# EAGLE design SolenoidBoard (EAGLE 9.4.1)
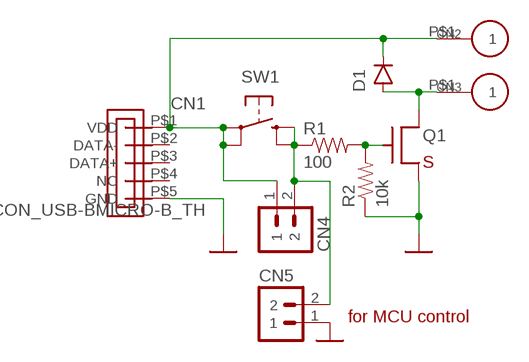
[diagram p0: schematic, sheet 1]

## Parts
CN1  CON_USB-BMICRO-B_TH  [USB-MICROB-TH]
CN2  CON_P01TH09MM  [PAD_TH09MM]
CN3  CON_P01TH09MM  [PAD_TH09MM]
CN4  CON_PINHD-1X290  [1X02/90]
CN5  CON_PINHD-1X2PTH  [SPARKFUN_1X02]
D1  DIODESOD123FL  [SOD123FL]
Q1  TR_NMOS_IRLML6344  [SOT-23-3-2916]
R1  100  RES0603  [0603]
R2  10k  RES0603  [0603]
SW1  SW_TACTSMD_B3FS  [SW_B3FS-1]

## Nets
GND: CN1.P$5(GND) CN5.1 Q1.2(S) R2.1 ; supply symbol labelled POW_GND
N$1: CN3.P$1 D1.P$A Q1.3(D)
N$2: CN1.P$1(VDD) CN2.P$1 CN4.1 D1.P$K SW1.P$1(P) SW1.P$2(P1)
N$3: Q1.1(G) R1.2 R2.2
N$4: CN4.2 CN5.2 R1.1 SW1.P$3(S) SW1.P$4(S1)
Unconnected: CN1.P$2(DATA-) CN1.P$3(DATA+) CN1.P$4(NC)

## Notes on the sheet
- for MCU control

## Library data of the parts
CN1 = akita:CON_USB-B
CN2 CN3 = akita:CON_P01
CN4 CN5 = akita:CON_PINHD-1X2: Header 2 Standard 2-pin 0.1" header. Use with straight break away headers (SKU : PRT-00116), right angle break away headers (PRT-00553), swiss pins (PRT-00743), machine pins (PRT-00117), and female headers (PRT-00115). Molex polarized connector foot print use with SKU : PRT-08233 with associated crimp pins and housings.
D1 = akita:DIODE: Diode
Q1 = akita:TR_NMOS_IRLML6344
R1 R2 = akita:RES: Resistor Basic schematic elements and footprints for 0603, 1206, and PTH resistors.
SW1 = akita:SW_TACT: OMRON SWITCH

## Board
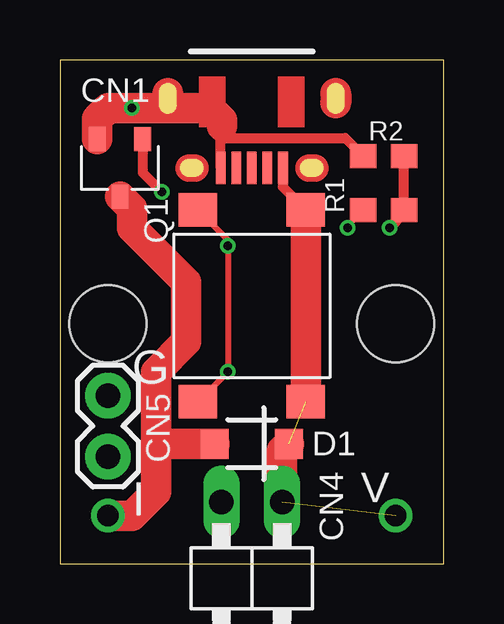
[diagram p1: board, top side]
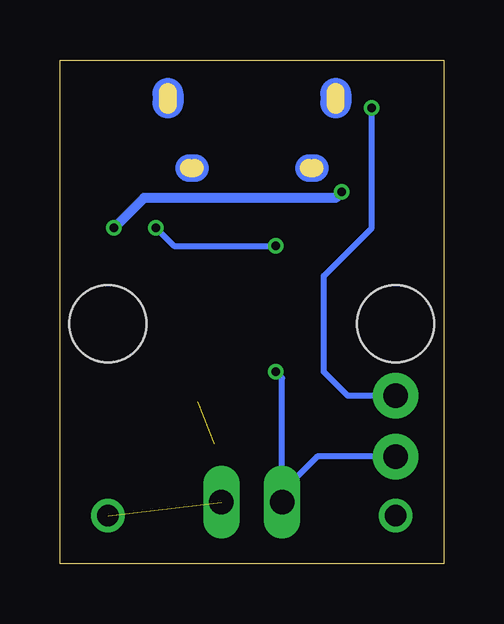
[diagram p2: board, bottom side, seen from below]

Size 16 x 21 mm. Coordinates in mm from the lower left corner, seen from the top.
Outline: 0,0 16,0 16,21 0,21 0,0
Copper layers (1*16): Top 0.035mm / dielectric 1.5mm / Bottom 0.035mm
Design rules "SeeedStudio_2layer_DRU_no_angle_20140221": minimum track width 6mil, minimum drill 12mil, track to track 6mil, track to pad 6mil, pad to pad 6mil, via to via 6mil, smd to smd 0mil, copper to edge 10mil, drill to drill 10mil, minimum pad ring 10mil, minimum via ring 6mil, stop-mask expansion 2mil, vias tented up to drill 100mil, thermal gap 10mil
Holes 3.2 mm at 2,10 14,10

### Footprints (pad centres in the part's own frame; a part is rotated, then mirrored left to right if it is on the bottom)
USB-MICROB-TH = smd 0.4 x 1.35: P$1 -1.3,1.5; P$2 -0.65,1.5; P$3 0,1.5; P$4 0.65,1.5; P$5 1.3,1.5
PAD_TH09MM = drill 0.9: P$1 0,0
1X02/90 = drill 1.016 long: 1 -1.27,-3.81; 2 1.27,-3.81
SPARKFUN_1X02 = drill 1.016 pad 1.88: 1 0,0; 2 2.54,0
SOD123FL = smd 1.15 x 1.25: P$A -1.55,0; P$K 1.55,0
SOT-23-3-2916 = smd 0.7 x 1: 1 -0.95,-1.2; 2 0.95,-1.2; 3 0,1.2
0603 = smd 1.1 x 1: 1 -0.85,0; 2 0.85,0
SW_B3FS-1 = smd 1.4 x 1.6: P$1 4,-2.25; P$2 -4,-2.25; P$3 4,2.25; P$4 -4,2.25

### Placement (x,y rotation side)
CN1  8,18 180 top
CN2  14,2 0 top
CN3  2,2 0 top
CN4  8,-1.25 180 top
CN5  2,7 270 top
D1  8,5 0 top
Q1  2.5,16.5 180 top
R1  13.5,14.75 0 top
R2  13.5,17 0 top
SW1  8,10.75 90 top

### Tracks (layer width: path | path; a pad name or v marks a point on that pad's centre or on a via)
GND  (via drill 0.35)
  Top 0.254: 6.75,18.5 6.75,17.75
  Top 0.406: CN1.P$5 6.7,17.7 6.75,17.75 11.9,17.75 R2.1
  Top 1.27: Q1.2 1.55,18.55 2,19 v3,19 6.25,19 6.75,18.5 6.75,18.25
  Bottom 0.254: CN5.1 4,7 5,8 5,12 3,14 v3,19
N$1
  Top 1.27: Q1.3 3,14.8 3,14 5.25,11.75 5.25,9.25 4,8 4,5 | D1.P$A 4,5 | CN3.P$1 3,2 4,3 4,5
N$2  (2 unrouted)
  Top 0.406: CN1.P$1 9.3,15.7 SW1.P$1
  Top 1.27: SW1.P$2 SW1.P$1 | CN4.1 9.27,4.72 D1.P$K
N$3  (via drill 0.35)
  Top 0.406: Q1.1 3.45,16.3 v4.25,15.5 | v13.75,14 14.35,14.6 R1.2 R2.2
  Bottom 0.406: v4.25,15.5 4.5,15.25 12.5,15.25 v13.75,14
N$4  (via drill 0.35)
  Top 0.254: R1.1 12,14.1 v12,14 | SW1.P$3 7,13.5 v7,13.25 v7,8 SW1.P$4
  Bottom 0.254: v12,14 11.25,13.25 v7,13.25 | CN4.2 6.73,3 | 6.73,3 6.73,7.73 v7,8 | CN5.2 5.27,4.46 6.73,3

### Text on the board
tPlace: G | V | I